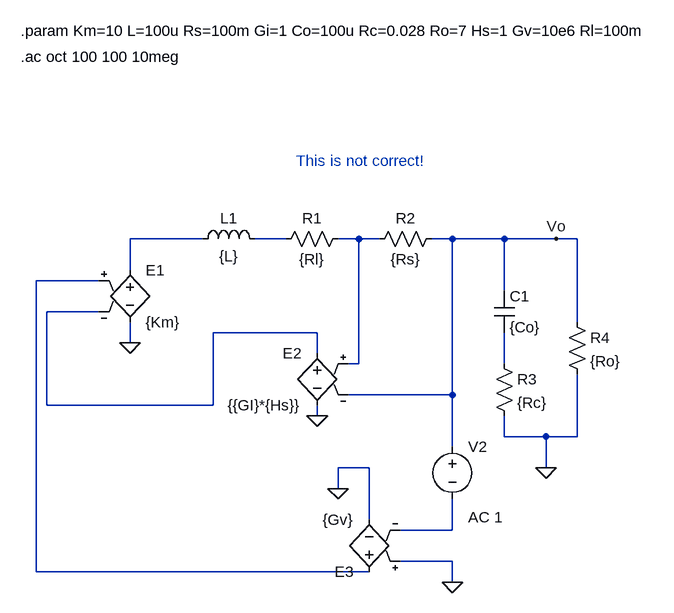
[diagram p0: schematic ACmodel.asc]
ACmodel.asc, the LTspice schematic file:
Version 4
SHEET 1 1004 680
WIRE 224 80 112 80
WIRE 352 80 304 80
WIRE 464 80 432 80
WIRE 496 80 464 80
WIRE 608 80 576 80
WIRE 688 80 608 80
WIRE 768 80 688 80
WIRE 800 80 768 80
WIRE 112 128 112 80
WIRE 64 144 -32 144
WIRE 688 160 688 80
WIRE 64 192 -16 192
WIRE 800 208 800 80
WIRE 400 224 240 224
WIRE 112 240 112 208
WIRE 400 256 400 224
WIRE 464 272 464 80
WIRE 464 272 448 272
WIRE 688 272 688 224
WIRE 608 320 608 80
WIRE 608 320 448 320
WIRE -16 336 -16 192
WIRE 240 336 240 224
WIRE 240 336 -16 336
WIRE 400 352 400 336
WIRE 688 384 688 352
WIRE 752 384 688 384
WIRE 800 384 800 288
WIRE 800 384 752 384
WIRE 608 400 608 320
WIRE 480 432 432 432
WIRE 752 432 752 384
WIRE 432 464 432 432
WIRE 480 512 480 432
WIRE 608 528 608 480
WIRE 608 528 528 528
WIRE 608 576 528 576
WIRE -32 592 -32 144
WIRE 480 592 -32 592
WIRE 608 608 608 576
FLAG 752 432 0
FLAG 608 608 0
FLAG 432 464 0
FLAG 400 352 0
FLAG 112 240 0
FLAG 768 80 Vo
SYMBOL e 112 112 R0
SYMATTR InstName E1
SYMATTR Value {Km}
SYMBOL ind 208 96 R270
WINDOW 0 32 56 VTop 2
WINDOW 3 5 56 VBottom 2
SYMATTR InstName L1
SYMATTR Value {L}
SYMBOL res 448 64 R90
WINDOW 0 0 56 VBottom 2
WINDOW 3 32 56 VTop 2
SYMATTR InstName R1
SYMATTR Value {Rl}
SYMBOL res 592 64 R90
WINDOW 0 0 56 VBottom 2
WINDOW 3 32 56 VTop 2
SYMATTR InstName R2
SYMATTR Value {Rs}
SYMBOL cap 672 160 R0
SYMATTR InstName C1
SYMATTR Value {Co}
SYMBOL res 672 256 R0
SYMATTR InstName R3
SYMATTR Value {Rc}
SYMBOL res 784 192 R0
SYMATTR InstName R4
SYMATTR Value {Ro}
SYMBOL e 400 240 M0
SYMATTR InstName E2
SYMATTR Value {{GI}*{Hs}}
SYMBOL voltage 608 384 R0
WINDOW 123 24 124 Left 2
WINDOW 39 0 0 Left 0
SYMATTR Value2 AC 1
SYMATTR InstName V2
SYMATTR Value ""
SYMBOL e 480 608 R180
SYMATTR InstName E3
SYMATTR Value {Gv}
TEXT -56 -240 Left 2 !.param Km=10 L=100u Rs=100m Gi=1 Co=100u Rc=0.028 Ro=7 Hs=1 Gv=10e6 Rl=100m
TEXT -56 -200 Left 2 !.ac oct 100 100 10meg
TEXT 368 -40 Left 2 ;This is not correct!

The netlist it stands for:
* ACmodel.asc
E1 N001 0 N004 N005 {Km}
L1 N001 N002 {L}
R1 N003 N002 {Rl}
R2 Vo N003 {Rs}
C1 Vo N006 {Co}
R3 N006 0 {Rc}
R4 Vo 0 {Ro}
E2 N005 0 N003 Vo {{GI}*{Hs}}
V2 Vo N007 AC 1
E3 N004 0 0 N007 {Gv}
.param Km=10 L=100u Rs=100m Gi=1 Co=100u Rc=0.028 Ro=7 Hs=1 Gv=10e6 Rl=100m
.ac oct 100 100 10meg
* This is not correct!
.backanno
.end